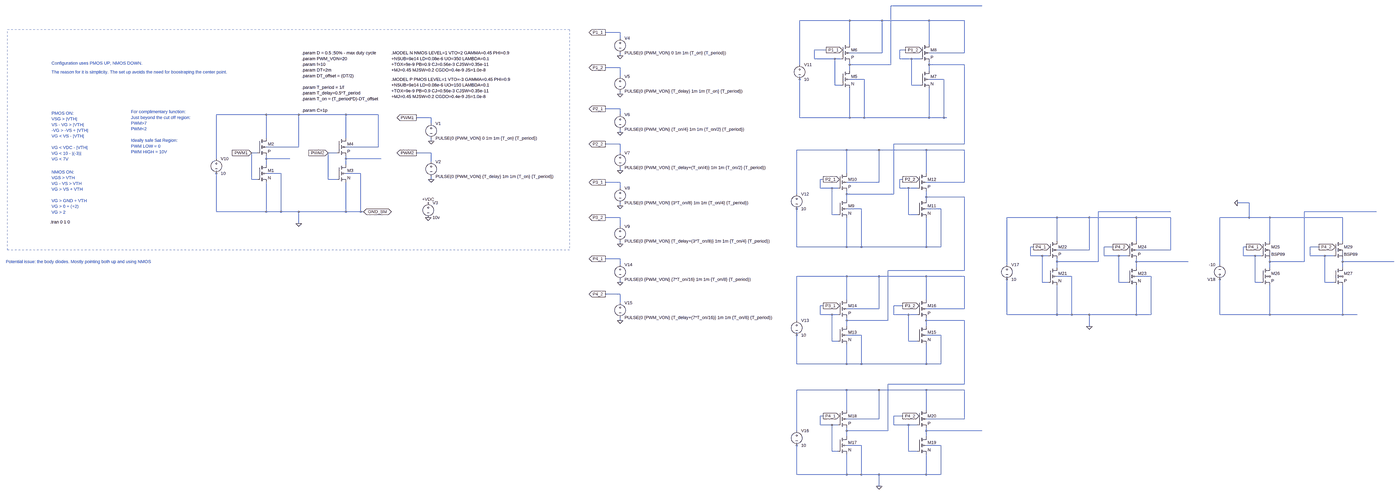
[diagram p0: schematic H-Bridge-4-SM.asc, whole sheet]
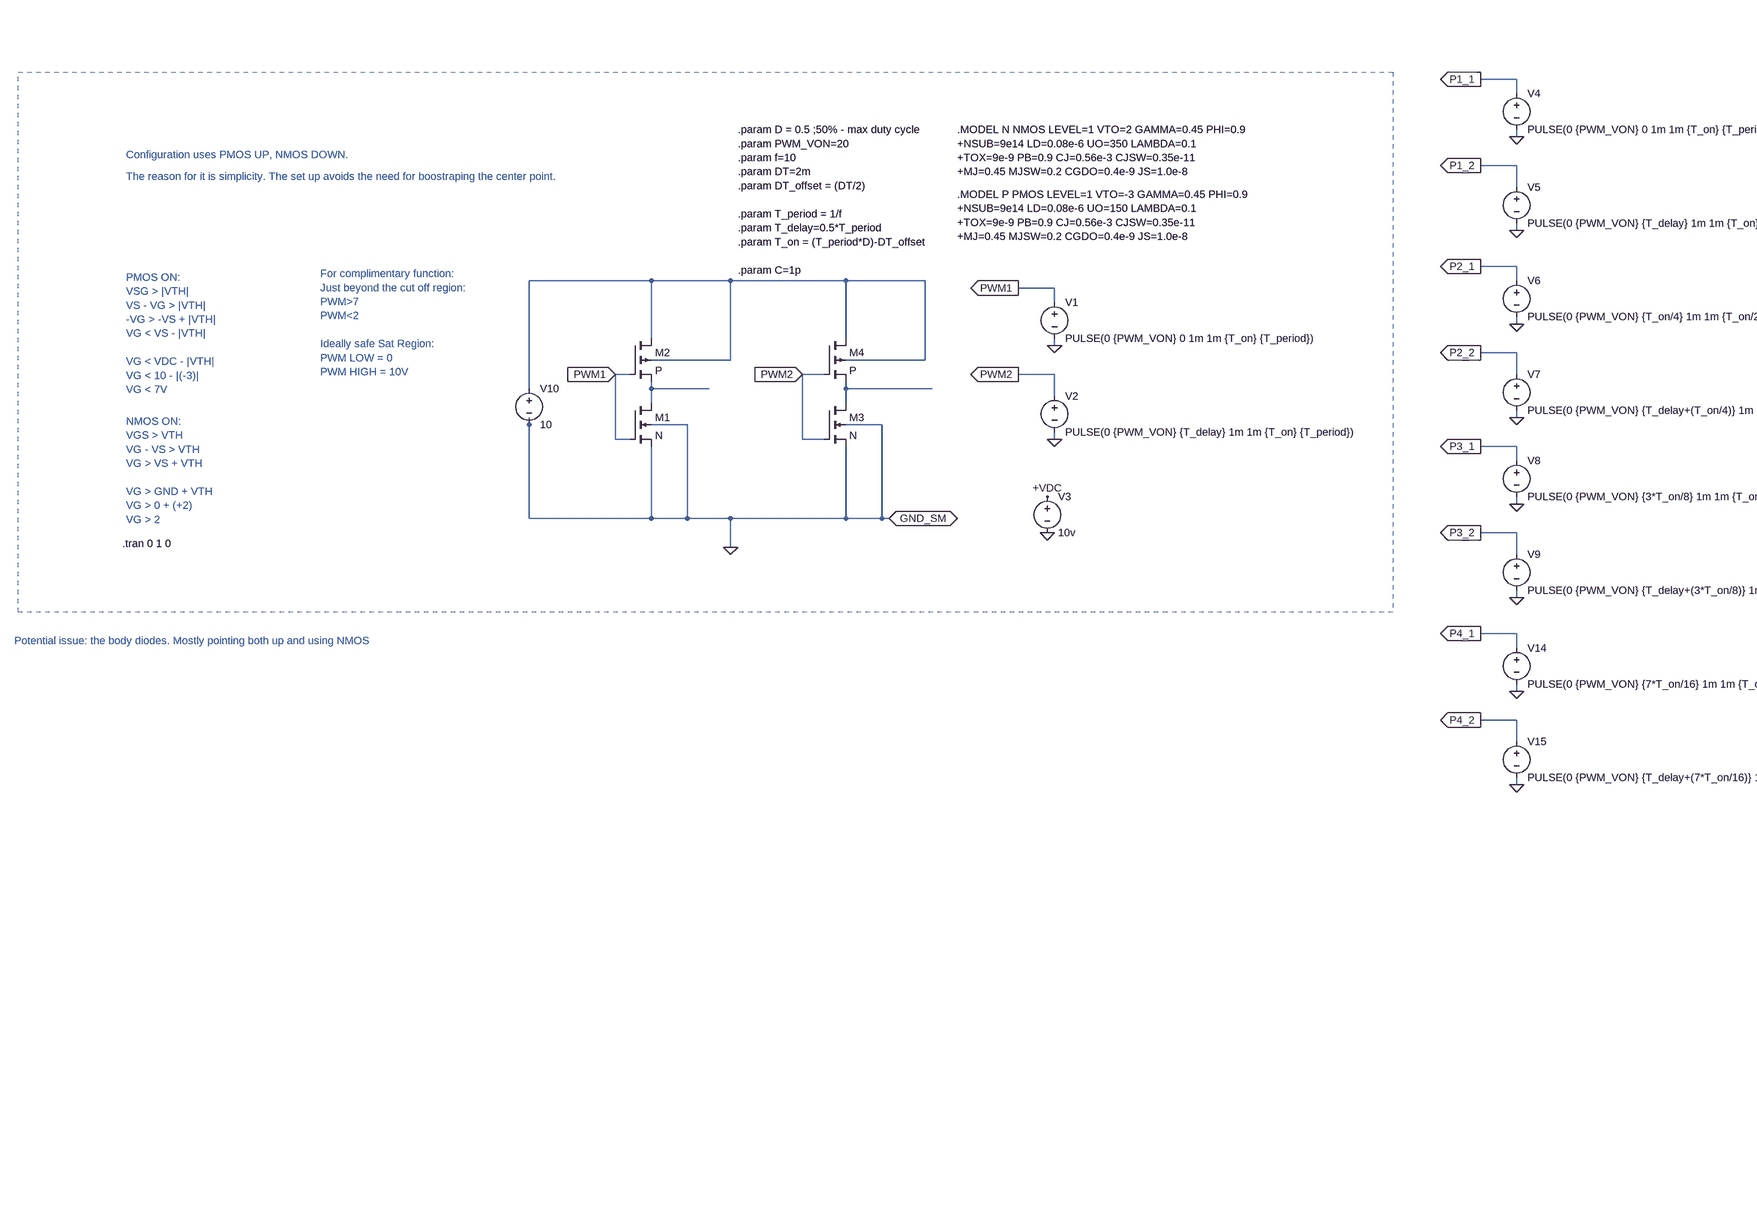
[diagram p1: schematic H-Bridge-4-SM.asc, part, row 1 of 1, column 1 of 2]
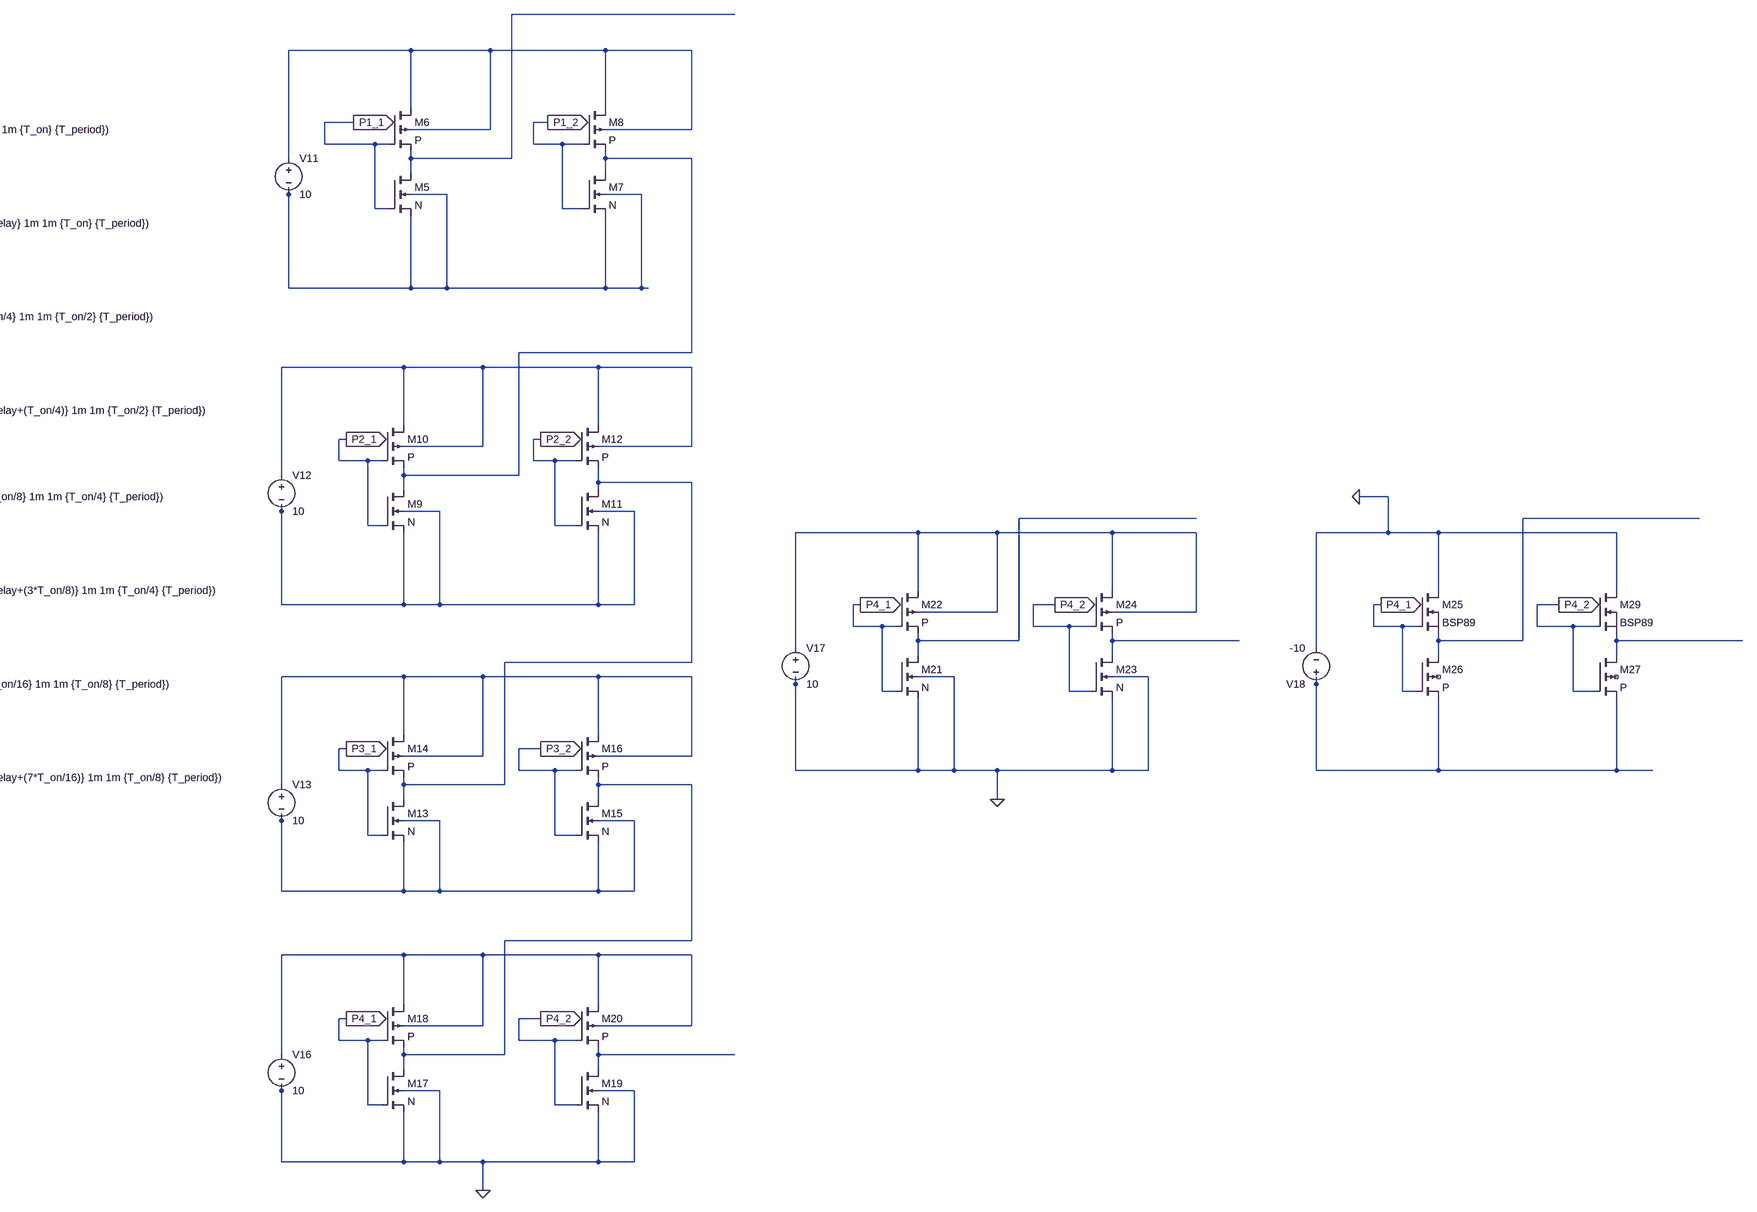
[diagram p2: schematic H-Bridge-4-SM.asc, part, row 1 of 1, column 2 of 2]
H-Bridge-4-SM.asc, the LTspice schematic file:
Version 4.1
SHEET 1 9444 2212
WIRE 5984 -560 5488 -560
WIRE 5264 -480 4992 -480
WIRE 5440 -480 5264 -480
WIRE 5696 -480 5440 -480
WIRE 5888 -480 5696 -480
WIRE 3856 -416 3776 -416
WIRE 3856 -384 3856 -416
WIRE 5264 -352 5264 -480
WIRE 5696 -352 5696 -480
WIRE 5136 -320 5072 -320
WIRE 5568 -320 5536 -320
WIRE 5440 -304 5440 -480
WIRE 5440 -304 5264 -304
WIRE 5888 -304 5888 -480
WIRE 5888 -304 5696 -304
WIRE 3856 -288 3856 -304
WIRE 5072 -272 5072 -320
WIRE 5184 -272 5072 -272
WIRE 5216 -272 5184 -272
WIRE 5536 -272 5536 -320
WIRE 5600 -272 5536 -272
WIRE 5648 -272 5600 -272
WIRE 4992 -240 4992 -480
WIRE 5264 -240 5264 -256
WIRE 5488 -240 5488 -560
WIRE 5488 -240 5264 -240
WIRE 5696 -240 5696 -256
WIRE 5888 -240 5696 -240
WIRE 3856 -224 3776 -224
WIRE 5264 -208 5264 -240
WIRE 5696 -208 5696 -240
WIRE 3856 -176 3856 -224
WIRE 4992 -160 4992 -176
WIRE 5344 -160 5264 -160
WIRE 5776 -160 5696 -160
WIRE 5184 -128 5184 -272
WIRE 5216 -128 5184 -128
WIRE 5600 -128 5600 -272
WIRE 5648 -128 5600 -128
WIRE 3856 -80 3856 -96
WIRE 3856 0 3776 0
WIRE 1728 32 1456 32
WIRE 1904 32 1728 32
WIRE 2160 32 1904 32
WIRE 2336 32 2160 32
WIRE 3856 32 3856 0
WIRE 2624 48 2544 48
WIRE 4992 48 4992 -160
WIRE 5264 48 5264 -112
WIRE 5264 48 4992 48
WIRE 5344 48 5344 -160
WIRE 5344 48 5264 48
WIRE 5696 48 5696 -112
WIRE 5696 48 5344 48
WIRE 5776 48 5776 -160
WIRE 5776 48 5696 48
WIRE 5792 48 5776 48
WIRE 2624 80 2624 48
WIRE 3856 128 3856 112
WIRE 1728 160 1728 32
WIRE 2160 160 2160 32
WIRE 2624 176 2624 160
WIRE 3856 192 3776 192
WIRE 5888 192 5888 -240
WIRE 5888 192 5504 192
WIRE 1904 208 1904 32
WIRE 1904 208 1728 208
WIRE 2336 208 2336 32
WIRE 2336 208 2160 208
WIRE 5248 224 4976 224
WIRE 5424 224 5248 224
WIRE 5680 224 5424 224
WIRE 5888 224 5680 224
WIRE 1680 240 1648 240
WIRE 2112 240 2064 240
WIRE 2624 240 2544 240
WIRE 3856 240 3856 192
WIRE 1456 272 1456 32
WIRE 1728 272 1728 256
WIRE 1856 272 1728 272
WIRE 2160 272 2160 256
WIRE 2352 272 2160 272
WIRE 2624 288 2624 240
WIRE 1728 304 1728 272
WIRE 2160 304 2160 272
WIRE 3856 336 3856 320
WIRE 1456 352 1456 336
WIRE 1808 352 1728 352
WIRE 2240 352 2160 352
WIRE 5248 352 5248 224
WIRE 5680 352 5680 224
WIRE 1648 384 1648 240
WIRE 1680 384 1648 384
WIRE 2064 384 2064 240
WIRE 2112 384 2064 384
WIRE 2624 384 2624 368
WIRE 5120 384 5104 384
WIRE 5552 384 5536 384
WIRE 3856 400 3776 400
WIRE 5424 400 5424 224
WIRE 5424 400 5248 400
WIRE 5888 400 5888 224
WIRE 5888 400 5680 400
WIRE 3856 432 3856 400
WIRE 5104 432 5104 384
WIRE 5168 432 5104 432
WIRE 5200 432 5168 432
WIRE 5536 432 5536 384
WIRE 5584 432 5536 432
WIRE 5632 432 5584 432
WIRE 4976 464 4976 224
WIRE 5248 464 5248 448
WIRE 5504 464 5504 192
WIRE 5504 464 5248 464
WIRE 5680 480 5680 448
WIRE 5888 480 5680 480
WIRE 5248 496 5248 464
WIRE 5680 496 5680 480
WIRE 8416 512 8352 512
WIRE 3856 528 3856 512
WIRE 4976 544 4976 528
WIRE 5328 544 5248 544
WIRE 5760 544 5680 544
WIRE 1456 560 1456 352
WIRE 1728 560 1728 400
WIRE 1728 560 1456 560
WIRE 1808 560 1808 352
WIRE 1808 560 1728 560
WIRE 1904 560 1808 560
WIRE 2160 560 2160 400
WIRE 2160 560 1904 560
WIRE 2240 560 2240 352
WIRE 2240 560 2160 560
WIRE 2256 560 2240 560
WIRE 7936 560 7520 560
WIRE 9168 560 8752 560
WIRE 5168 576 5168 432
WIRE 5200 576 5168 576
WIRE 5584 576 5584 432
WIRE 5632 576 5584 576
WIRE 3856 592 3776 592
WIRE 7296 592 7024 592
WIRE 7472 592 7296 592
WIRE 7728 592 7472 592
WIRE 7936 592 7728 592
WIRE 8416 592 8416 512
WIRE 8416 592 8256 592
WIRE 8528 592 8416 592
WIRE 8960 592 8528 592
WIRE 1904 624 1904 560
WIRE 3856 640 3856 592
WIRE 7296 720 7296 592
WIRE 7728 720 7728 592
WIRE 8528 720 8528 592
WIRE 8960 720 8960 592
WIRE 3856 736 3856 720
WIRE 4976 752 4976 544
WIRE 5248 752 5248 592
WIRE 5248 752 4976 752
WIRE 5328 752 5328 544
WIRE 5328 752 5248 752
WIRE 5680 752 5680 592
WIRE 5680 752 5328 752
WIRE 5760 752 5760 544
WIRE 5760 752 5680 752
WIRE 7168 752 7152 752
WIRE 7600 752 7552 752
WIRE 8400 752 8384 752
WIRE 8832 752 8784 752
WIRE 7472 768 7472 592
WIRE 7472 768 7296 768
WIRE 7936 768 7936 592
WIRE 7936 768 7728 768
WIRE 7152 800 7152 752
WIRE 7216 800 7152 800
WIRE 7248 800 7216 800
WIRE 7552 800 7552 752
WIRE 7632 800 7552 800
WIRE 7680 800 7632 800
WIRE 8384 800 8384 752
WIRE 8448 800 8384 800
WIRE 8480 800 8448 800
WIRE 8784 800 8784 752
WIRE 8864 800 8784 800
WIRE 8912 800 8864 800
WIRE 3856 816 3776 816
WIRE 7296 832 7296 816
WIRE 7520 832 7520 560
WIRE 7520 832 7296 832
WIRE 7728 832 7728 816
WIRE 8032 832 7728 832
WIRE 8528 832 8528 816
WIRE 8752 832 8752 560
WIRE 8752 832 8528 832
WIRE 8960 832 8960 816
WIRE 9264 832 8960 832
WIRE 3856 848 3856 816
WIRE 7024 848 7024 592
WIRE 8256 848 8256 592
WIRE 7296 864 7296 832
WIRE 7728 864 7728 832
WIRE 8528 864 8528 832
WIRE 8960 864 8960 832
WIRE 5888 880 5888 480
WIRE 5888 880 5472 880
WIRE 5248 912 4976 912
WIRE 5424 912 5248 912
WIRE 5680 912 5424 912
WIRE 5888 912 5680 912
WIRE 7376 912 7296 912
WIRE 7808 912 7728 912
WIRE 7024 928 7024 912
WIRE 8256 928 8256 912
WIRE 3856 944 3856 928
WIRE 7216 944 7216 800
WIRE 7248 944 7216 944
WIRE 7632 944 7632 800
WIRE 7680 944 7632 944
WIRE 8448 944 8448 800
WIRE 8480 944 8448 944
WIRE 8864 944 8864 800
WIRE 8912 944 8864 944
WIRE 3856 1008 3776 1008
WIRE 5248 1040 5248 912
WIRE 5680 1040 5680 912
WIRE 3856 1056 3856 1008
WIRE 5120 1072 5104 1072
WIRE 5552 1072 5504 1072
WIRE 5424 1088 5424 912
WIRE 5424 1088 5248 1088
WIRE 5888 1088 5888 912
WIRE 5888 1088 5680 1088
WIRE 5104 1120 5104 1072
WIRE 5168 1120 5104 1120
WIRE 5200 1120 5168 1120
WIRE 5504 1120 5504 1072
WIRE 5584 1120 5504 1120
WIRE 5632 1120 5584 1120
WIRE 7024 1120 7024 928
WIRE 7296 1120 7296 960
WIRE 7296 1120 7024 1120
WIRE 7376 1120 7376 912
WIRE 7376 1120 7296 1120
WIRE 7472 1120 7376 1120
WIRE 7728 1120 7728 960
WIRE 7728 1120 7472 1120
WIRE 7808 1120 7808 912
WIRE 7808 1120 7728 1120
WIRE 8256 1120 8256 928
WIRE 8528 1120 8528 960
WIRE 8528 1120 8256 1120
WIRE 8960 1120 8960 960
WIRE 8960 1120 8528 1120
WIRE 9040 1120 8960 1120
WIRE 3856 1152 3856 1136
WIRE 4976 1152 4976 912
WIRE 5248 1152 5248 1136
WIRE 5472 1152 5472 880
WIRE 5472 1152 5248 1152
WIRE 5680 1152 5680 1136
WIRE 5888 1152 5680 1152
WIRE 5248 1184 5248 1152
WIRE 5680 1184 5680 1152
WIRE 7472 1184 7472 1120
WIRE 4976 1232 4976 1216
WIRE 5328 1232 5248 1232
WIRE 5760 1232 5680 1232
WIRE 5168 1264 5168 1120
WIRE 5200 1264 5168 1264
WIRE 5584 1264 5584 1120
WIRE 5632 1264 5584 1264
WIRE 4976 1440 4976 1232
WIRE 5248 1440 5248 1280
WIRE 5248 1440 4976 1440
WIRE 5328 1440 5328 1232
WIRE 5328 1440 5248 1440
WIRE 5680 1440 5680 1280
WIRE 5680 1440 5328 1440
WIRE 5760 1440 5760 1232
WIRE 5760 1440 5680 1440
WIRE 5888 1568 5888 1152
WIRE 5888 1568 5472 1568
WIRE 5248 1600 4976 1600
WIRE 5424 1600 5248 1600
WIRE 5680 1600 5424 1600
WIRE 5888 1600 5680 1600
WIRE 5248 1728 5248 1600
WIRE 5680 1728 5680 1600
WIRE 5120 1760 5104 1760
WIRE 5552 1760 5504 1760
WIRE 5424 1776 5424 1600
WIRE 5424 1776 5248 1776
WIRE 5888 1776 5888 1600
WIRE 5888 1776 5680 1776
WIRE 5104 1808 5104 1760
WIRE 5168 1808 5104 1808
WIRE 5200 1808 5168 1808
WIRE 5504 1808 5504 1760
WIRE 5584 1808 5504 1808
WIRE 5632 1808 5584 1808
WIRE 4976 1840 4976 1600
WIRE 5248 1840 5248 1824
WIRE 5472 1840 5472 1568
WIRE 5472 1840 5248 1840
WIRE 5680 1840 5680 1824
WIRE 5984 1840 5680 1840
WIRE 5248 1872 5248 1840
WIRE 5680 1872 5680 1840
WIRE 4976 1920 4976 1904
WIRE 5328 1920 5248 1920
WIRE 5760 1920 5680 1920
WIRE 5168 1952 5168 1808
WIRE 5200 1952 5168 1952
WIRE 5584 1952 5584 1808
WIRE 5632 1952 5584 1952
WIRE 4976 2128 4976 1920
WIRE 5248 2128 5248 1968
WIRE 5248 2128 4976 2128
WIRE 5328 2128 5328 1920
WIRE 5328 2128 5248 2128
WIRE 5424 2128 5328 2128
WIRE 5680 2128 5680 1968
WIRE 5680 2128 5424 2128
WIRE 5760 2128 5760 1920
WIRE 5760 2128 5680 2128
WIRE 5424 2192 5424 2128
FLAG 1648 240 PWM1
IOPIN 1648 240 In
FLAG 2064 240 PWM2
IOPIN 2064 240 In
FLAG 2624 176 0
FLAG 2624 384 0
FLAG 2544 48 PWM1
IOPIN 2544 48 Out
FLAG 2544 240 PWM2
IOPIN 2544 240 Out
FLAG 2256 560 GND_SM
IOPIN 2256 560 BiDir
FLAG 2608 512 +VDC
FLAG 2608 592 0
FLAG 1904 624 0
FLAG 3856 -288 0
FLAG 3856 -80 0
FLAG 3776 -416 P1_1
IOPIN 3776 -416 Out
FLAG 3776 -224 P1_2
IOPIN 3776 -224 Out
FLAG 3856 128 0
FLAG 3856 336 0
FLAG 3776 0 P2_1
IOPIN 3776 0 Out
FLAG 3776 192 P2_2
IOPIN 3776 192 Out
FLAG 3856 528 0
FLAG 3856 736 0
FLAG 3776 400 P3_1
IOPIN 3776 400 Out
FLAG 3776 592 P3_2
IOPIN 3776 592 Out
FLAG 5136 -320 P1_1
IOPIN 5136 -320 Out
FLAG 5568 -320 P1_2
IOPIN 5568 -320 Out
FLAG 5120 384 P2_1
IOPIN 5120 384 Out
FLAG 5552 384 P2_2
IOPIN 5552 384 Out
FLAG 5120 1072 P3_1
IOPIN 5120 1072 Out
FLAG 5552 1072 P3_2
IOPIN 5552 1072 Out
FLAG 3856 944 0
FLAG 3856 1152 0
FLAG 3776 816 P4_1
IOPIN 3776 816 Out
FLAG 3776 1008 P4_2
IOPIN 3776 1008 Out
FLAG 5424 2192 0
FLAG 5120 1760 P4_1
IOPIN 5120 1760 Out
FLAG 5552 1760 P4_2
IOPIN 5552 1760 Out
FLAG 7472 1184 0
FLAG 7168 752 P4_1
IOPIN 7168 752 Out
FLAG 7600 752 P4_2
IOPIN 7600 752 Out
FLAG 8400 752 P4_1
IOPIN 8400 752 Out
FLAG 8832 752 P4_2
IOPIN 8832 752 Out
FLAG 8352 512 0
SYMBOL nmos4 1680 304 R0
SYMATTR InstName M1
SYMATTR Value N
SYMBOL pmos4 1680 160 R0
SYMATTR InstName M2
SYMATTR Value P
SYMBOL nmos4 2112 304 R0
SYMATTR InstName M3
SYMATTR Value N
SYMBOL pmos4 2112 160 R0
SYMATTR InstName M4
SYMATTR Value P
SYMBOL voltage 2624 64 R0
WINDOW 123 0 0 Left 0
WINDOW 39 0 0 Left 0
SYMATTR InstName V1
SYMATTR Value PULSE(0 {PWM_VON} 0 1m 1m {T_on} {T_period})
SYMBOL voltage 2624 272 R0
WINDOW 123 0 0 Left 0
WINDOW 39 0 0 Left 0
SYMATTR InstName V2
SYMATTR Value PULSE(0 {PWM_VON} {T_delay} 1m 1m {T_on} {T_period})
SYMBOL voltage 2608 496 R0
WINDOW 123 0 0 Left 0
WINDOW 39 0 0 Left 0
SYMATTR InstName V3
SYMATTR Value 10v
SYMBOL voltage 3856 -400 R0
WINDOW 123 0 0 Left 0
WINDOW 39 0 0 Left 0
SYMATTR InstName V4
SYMATTR Value PULSE(0 {PWM_VON} 0 1m 1m {T_on} {T_period})
SYMBOL voltage 3856 -192 R0
WINDOW 123 0 0 Left 0
WINDOW 39 0 0 Left 0
SYMATTR InstName V5
SYMATTR Value PULSE(0 {PWM_VON} {T_delay} 1m 1m {T_on} {T_period})
SYMBOL voltage 3856 16 R0
WINDOW 123 0 0 Left 0
WINDOW 39 0 0 Left 0
SYMATTR InstName V6
SYMATTR Value PULSE(0 {PWM_VON} {T_on/4} 1m 1m {T_on/2} {T_period})
SYMBOL voltage 3856 224 R0
WINDOW 123 0 0 Left 0
WINDOW 39 0 0 Left 0
SYMATTR InstName V7
SYMATTR Value PULSE(0 {PWM_VON} {T_delay+(T_on/4)} 1m 1m {T_on/2} {T_period})
SYMBOL voltage 3856 416 R0
WINDOW 123 0 0 Left 0
WINDOW 39 0 0 Left 0
SYMATTR InstName V8
SYMATTR Value PULSE(0 {PWM_VON} {3*T_on/8} 1m 1m {T_on/4} {T_period})
SYMBOL voltage 3856 624 R0
WINDOW 123 0 0 Left 0
WINDOW 39 0 0 Left 0
SYMATTR InstName V9
SYMATTR Value PULSE(0 {PWM_VON} {T_delay+(3*T_on/8)} 1m 1m {T_on/4} {T_period})
SYMBOL voltage 1456 256 R0
WINDOW 123 0 0 Left 0
WINDOW 39 0 0 Left 0
SYMATTR InstName V10
SYMATTR Value 10
SYMBOL nmos4 5216 -208 R0
SYMATTR InstName M5
SYMATTR Value N
SYMBOL pmos4 5216 -352 R0
SYMATTR InstName M6
SYMATTR Value P
SYMBOL nmos4 5648 -208 R0
SYMATTR InstName M7
SYMATTR Value N
SYMBOL pmos4 5648 -352 R0
SYMATTR InstName M8
SYMATTR Value P
SYMBOL voltage 4992 -256 R0
WINDOW 123 0 0 Left 0
WINDOW 39 0 0 Left 0
SYMATTR InstName V11
SYMATTR Value 10
SYMBOL nmos4 5200 496 R0
SYMATTR InstName M9
SYMATTR Value N
SYMBOL pmos4 5200 352 R0
SYMATTR InstName M10
SYMATTR Value P
SYMBOL nmos4 5632 496 R0
SYMATTR InstName M11
SYMATTR Value N
SYMBOL pmos4 5632 352 R0
SYMATTR InstName M12
SYMATTR Value P
SYMBOL voltage 4976 448 R0
WINDOW 123 0 0 Left 0
WINDOW 39 0 0 Left 0
SYMATTR InstName V12
SYMATTR Value 10
SYMBOL nmos4 5200 1184 R0
SYMATTR InstName M13
SYMATTR Value N
SYMBOL pmos4 5200 1040 R0
SYMATTR InstName M14
SYMATTR Value P
SYMBOL nmos4 5632 1184 R0
SYMATTR InstName M15
SYMATTR Value N
SYMBOL pmos4 5632 1040 R0
SYMATTR InstName M16
SYMATTR Value P
SYMBOL voltage 4976 1136 R0
WINDOW 123 0 0 Left 0
WINDOW 39 0 0 Left 0
SYMATTR InstName V13
SYMATTR Value 10
SYMBOL voltage 3856 832 R0
WINDOW 123 0 0 Left 0
WINDOW 39 0 0 Left 0
SYMATTR InstName V14
SYMATTR Value PULSE(0 {PWM_VON} {7*T_on/16} 1m 1m {T_on/8} {T_period})
SYMBOL voltage 3856 1040 R0
WINDOW 123 0 0 Left 0
WINDOW 39 0 0 Left 0
SYMATTR InstName V15
SYMATTR Value PULSE(0 {PWM_VON} {T_delay+(7*T_on/16)} 1m 1m {T_on/8} {T_period})
SYMBOL nmos4 5200 1872 R0
SYMATTR InstName M17
SYMATTR Value N
SYMBOL pmos4 5200 1728 R0
SYMATTR InstName M18
SYMATTR Value P
SYMBOL nmos4 5632 1872 R0
SYMATTR InstName M19
SYMATTR Value N
SYMBOL pmos4 5632 1728 R0
SYMATTR InstName M20
SYMATTR Value P
SYMBOL voltage 4976 1824 R0
WINDOW 123 0 0 Left 0
WINDOW 39 0 0 Left 0
SYMATTR InstName V16
SYMATTR Value 10
SYMBOL nmos4 7248 864 R0
SYMATTR InstName M21
SYMATTR Value N
SYMBOL pmos4 7248 720 R0
SYMATTR InstName M22
SYMATTR Value P
SYMBOL nmos4 7680 864 R0
SYMATTR InstName M23
SYMATTR Value N
SYMBOL pmos4 7680 720 R0
SYMATTR InstName M24
SYMATTR Value P
SYMBOL voltage 7024 832 R0
WINDOW 123 0 0 Left 0
WINDOW 39 0 0 Left 0
SYMATTR InstName V17
SYMATTR Value 10
SYMBOL voltage 8256 944 R180
WINDOW 123 0 0 Left 0
WINDOW 39 0 0 Left 0
SYMATTR InstName V18
SYMATTR Value -10
SYMBOL nmos 8912 720 R0
SYMATTR InstName M29
SYMATTR Value BSP89
SYMBOL nmos 8480 720 R0
SYMATTR InstName M25
SYMATTR Value BSP89
SYMBOL pmos4 8480 864 R0
SYMATTR InstName M26
SYMATTR Value P
SYMBOL pmos4 8912 864 R0
SYMATTR InstName M27
SYMATTR Value P
TEXT 2408 -304 Left 2 !.MODEL N NMOS LEVEL=1 VTO=2 GAMMA=0.45 PHI=0.9\n+NSUB=9e14 LD=0.08e-6 UO=350 LAMBDA=0.1\n+TOX=9e-9 PB=0.9 CJ=0.56e-3 CJSW=0.35e-11\n+MJ=0.45 MJSW=0.2 CGDO=0.4e-9 JS=1.0e-8
TEXT 2408 -160 Left 2 !.MODEL P PMOS LEVEL=1 VTO=-3 GAMMA=0.45 PHI=0.9\n+NSUB=9e14 LD=0.08e-6 UO=150 LAMBDA=0.1\n+TOX=9e-9 PB=0.9 CJ=0.56e-3 CJSW=0.35e-11\n+MJ=0.45 MJSW=0.2 CGDO=0.4e-9 JS=1.0e-8
TEXT 560 -248 Left 2 ;Configuration uses PMOS UP, NMOS DOWN.
TEXT 560 -200 Left 2 ;The reason for it is simplicity. The set up avoids the need for boostraping the center point.
TEXT 560 24 Left 2 ;PMOS ON: \nVSG > |VTH| \nVS - VG > |VTH| \n-VG > -VS + |VTH| \nVG < VS - |VTH| \n \nVG < VDC - |VTH| \nVG < 10 - |(-3)|\nVG < 7V
TEXT 560 344 Left 2 ;NMOS ON:\nVGS > VTH\nVG - VS > VTH \nVG > VS + VTH\n \nVG > GND + VTH \nVG > 0 + (+2) \nVG > 2
TEXT 992 16 Left 2 ;For complimentary function: \nJust beyond the cut off region: \nPWM>7 \nPWM<2\n \nIdeally safe Sat Region: \nPWM LOW = 0\nPWM HIGH = 10V
TEXT 552 616 Left 2 !.tran 0 1 0
TEXT 1920 -304 Left 2 !.param D = 0.5 ;50% - max duty cycle\n.param PWM_VON=20\n.param f=10\n.param DT=2m\n.param DT_offset = (DT/2)\n \n.param T_period = 1/f\n.param T_delay=0.5*T_period\n.param T_on = (T_period*D)-DT_offset\n \n.param C=1p
TEXT 312 832 Left 2 ;Potential issue: the body diodes. Mostly pointing both up and using NMOS
RECTANGLE Normal 3376 768 320 -432 2

The netlist it stands for:
* H-Bridge-4-SM.asc
M1 N007 PWM1 0 0 N
M2 N005 PWM1 N007 N005 P
M3 N008 PWM2 0 0 N
M4 N005 PWM2 N008 N005 P
V1 PWM1 0 PULSE(0 {PWM_VON} 0 1m 1m {T_on} {T_period})
V2 PWM2 0 PULSE(0 {PWM_VON} {T_delay} 1m 1m {T_on} {T_period})
V3 +VDC 0 10v
V4 P1_1 0 PULSE(0 {PWM_VON} 0 1m 1m {T_on} {T_period})
V5 P1_2 0 PULSE(0 {PWM_VON} {T_delay} 1m 1m {T_on} {T_period})
V6 P2_1 0 PULSE(0 {PWM_VON} {T_on/4} 1m 1m {T_on/2} {T_period})
V7 P2_2 0 PULSE(0 {PWM_VON} {T_delay+(T_on/4)} 1m 1m {T_on/2} {T_period})
V8 P3_1 0 PULSE(0 {PWM_VON} {3*T_on/8} 1m 1m {T_on/4} {T_period})
V9 P3_2 0 PULSE(0 {PWM_VON} {T_delay+(3*T_on/8)} 1m 1m {T_on/4} {T_period})
V10 N005 0 10
M5 N001 P1_1 N004 N004 N
M6 N002 P1_1 N001 N002 P
M7 N003 P1_2 N004 N004 N
M8 N002 P1_2 N003 N002 P
V11 N002 N004 10
M9 N003 P2_1 N010 N010 N
M10 N006 P2_1 N003 N006 P
M11 N009 P2_2 N010 N010 N
M12 N006 P2_2 N009 N006 P
V12 N006 N010 10
M13 N009 P3_1 N019 N019 N
M14 N016 P3_1 N009 N016 P
M15 N018 P3_2 N019 N019 N
M16 N016 P3_2 N018 N016 P
V13 N016 N019 10
V14 P4_1 0 PULSE(0 {PWM_VON} {7*T_on/16} 1m 1m {T_on/8} {T_period})
V15 P4_2 0 PULSE(0 {PWM_VON} {T_delay+(7*T_on/16)} 1m 1m {T_on/8} {T_period})
M17 N018 P4_1 0 0 N
M18 N020 P4_1 N018 N020 P
M19 N021 P4_2 0 0 N
M20 N020 P4_2 N021 N020 P
V16 N020 0 10
M21 N011 P4_1 0 0 N
M22 N013 P4_1 N011 N013 P
M23 N014 P4_2 0 0 N
M24 N013 P4_2 N014 N013 P
V17 N013 0 10
V18 N017 0 -10
M29 0 P4_2 N015 N015 BSP89
M25 0 P4_1 N012 N012 BSP89
M26 N012 P4_1 N017 NC_01 P
M27 N015 P4_2 N017 NC_02 P
.model NMOS NMOS
.model PMOS PMOS
.lib standard.mos
.MODEL N NMOS LEVEL=1 VTO=2 GAMMA=0.45 PHI=0.9
+NSUB=9e14 LD=0.08e-6 UO=350 LAMBDA=0.1
+TOX=9e-9 PB=0.9 CJ=0.56e-3 CJSW=0.35e-11
+MJ=0.45 MJSW=0.2 CGDO=0.4e-9 JS=1.0e-8
.MODEL P PMOS LEVEL=1 VTO=-3 GAMMA=0.45 PHI=0.9
+NSUB=9e14 LD=0.08e-6 UO=150 LAMBDA=0.1
+TOX=9e-9 PB=0.9 CJ=0.56e-3 CJSW=0.35e-11
+MJ=0.45 MJSW=0.2 CGDO=0.4e-9 JS=1.0e-8
* Configuration uses PMOS UP, NMOS DOWN.
* The reason for it is simplicity. The set up avoids the need for boostraping the center point.
* PMOS ON:
* VSG > |VTH|
* VS - VG > |VTH|
* -VG > -VS + |VTH|
* VG < VS - |VTH|
* VG < VDC - |VTH|
* VG < 10 - |(-3)|
* VG < 7V
* NMOS ON:
* VGS > VTH
* VG - VS > VTH
* VG > VS + VTH
* VG > GND + VTH
* VG > 0 + (+2)
* VG > 2
* For complimentary function:
* Just beyond the cut off region:
* PWM>7
* PWM<2
* Ideally safe Sat Region:
* PWM LOW = 0
* PWM HIGH = 10V
.tran 0 1 0
.param D = 0.5 ;50% - max duty cycle
.param PWM_VON=20
.param f=10
.param DT=2m
.param DT_offset = (DT/2)
.param T_period = 1/f
.param T_delay=0.5*T_period
.param T_on = (T_period*D)-DT_offset
.param C=1p
* Potential issue: the body diodes. Mostly pointing both up and using NMOS
.backanno
.end